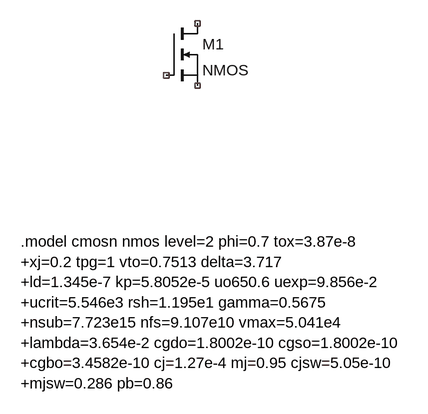
[diagram p0: schematic Draft1.asc]
Draft1.asc, the LTspice schematic file:
Version 4
SHEET 1 880 680
SYMBOL nmos 336 -112 R0
SYMATTR InstName M1
TEXT 112 224 Left 2 !.model cmosn nmos level=2 phi=0.7 tox=3.87e-8\n+xj=0.2 tpg=1 vto=0.7513 delta=3.717\n+ld=1.345e-7 kp=5.8052e-5 uo650.6 uexp=9.856e-2\n+ucrit=5.546e3 rsh=1.195e1 gamma=0.5675\n+nsub=7.723e15 nfs=9.107e10 vmax=5.041e4\n+lambda=3.654e-2 cgdo=1.8002e-10 cgso=1.8002e-10\n+cgbo=3.4582e-10 cj=1.27e-4 mj=0.95 cjsw=5.05e-10\n+mjsw=0.286 pb=0.86

The netlist it stands for:
* Draft1.asc
M1 NC_01 NC_02 NC_03 NC_03 NMOS
.model NMOS NMOS
.model PMOS PMOS
.lib standard.mos
.model cmosn nmos level=2 phi=0.7 tox=3.87e-8
+xj=0.2 tpg=1 vto=0.7513 delta=3.717
+ld=1.345e-7 kp=5.8052e-5 uo650.6 uexp=9.856e-2
+ucrit=5.546e3 rsh=1.195e1 gamma=0.5675
+nsub=7.723e15 nfs=9.107e10 vmax=5.041e4
+lambda=3.654e-2 cgdo=1.8002e-10 cgso=1.8002e-10
+cgbo=3.4582e-10 cj=1.27e-4 mj=0.95 cjsw=5.05e-10
+mjsw=0.286 pb=0.86
.backanno
.end